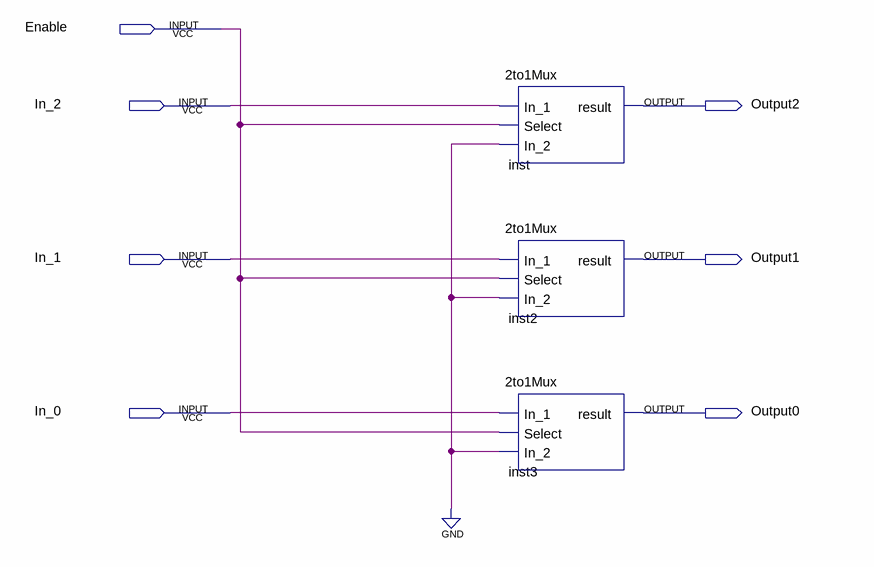
[diagram p0: schematic sheet]
// Quartus schematic output.bdf as structural Verilog: 3 symbols, 7 pins
module \output  (
  input  Enable,
  input  In_2,
  input  In_1,
  input  In_0,
  output Output2,
  output Output1,
  output Output0
);

  \2to1Mux  inst (.In_1(In_2), .Select(Enable), .In_2(1'b0), .result(Output2));
  \2to1Mux  inst2 (.In_1(In_1), .Select(Enable), .In_2(1'b0), .result(Output1));
  \2to1Mux  inst3 (.In_1(In_0), .Select(Enable), .In_2(1'b0), .result(Output0));
endmodule
